# EAGLE schematic SparkFun RTK Express (EAGLE 9.6.2)

## Sheet 1 of 2
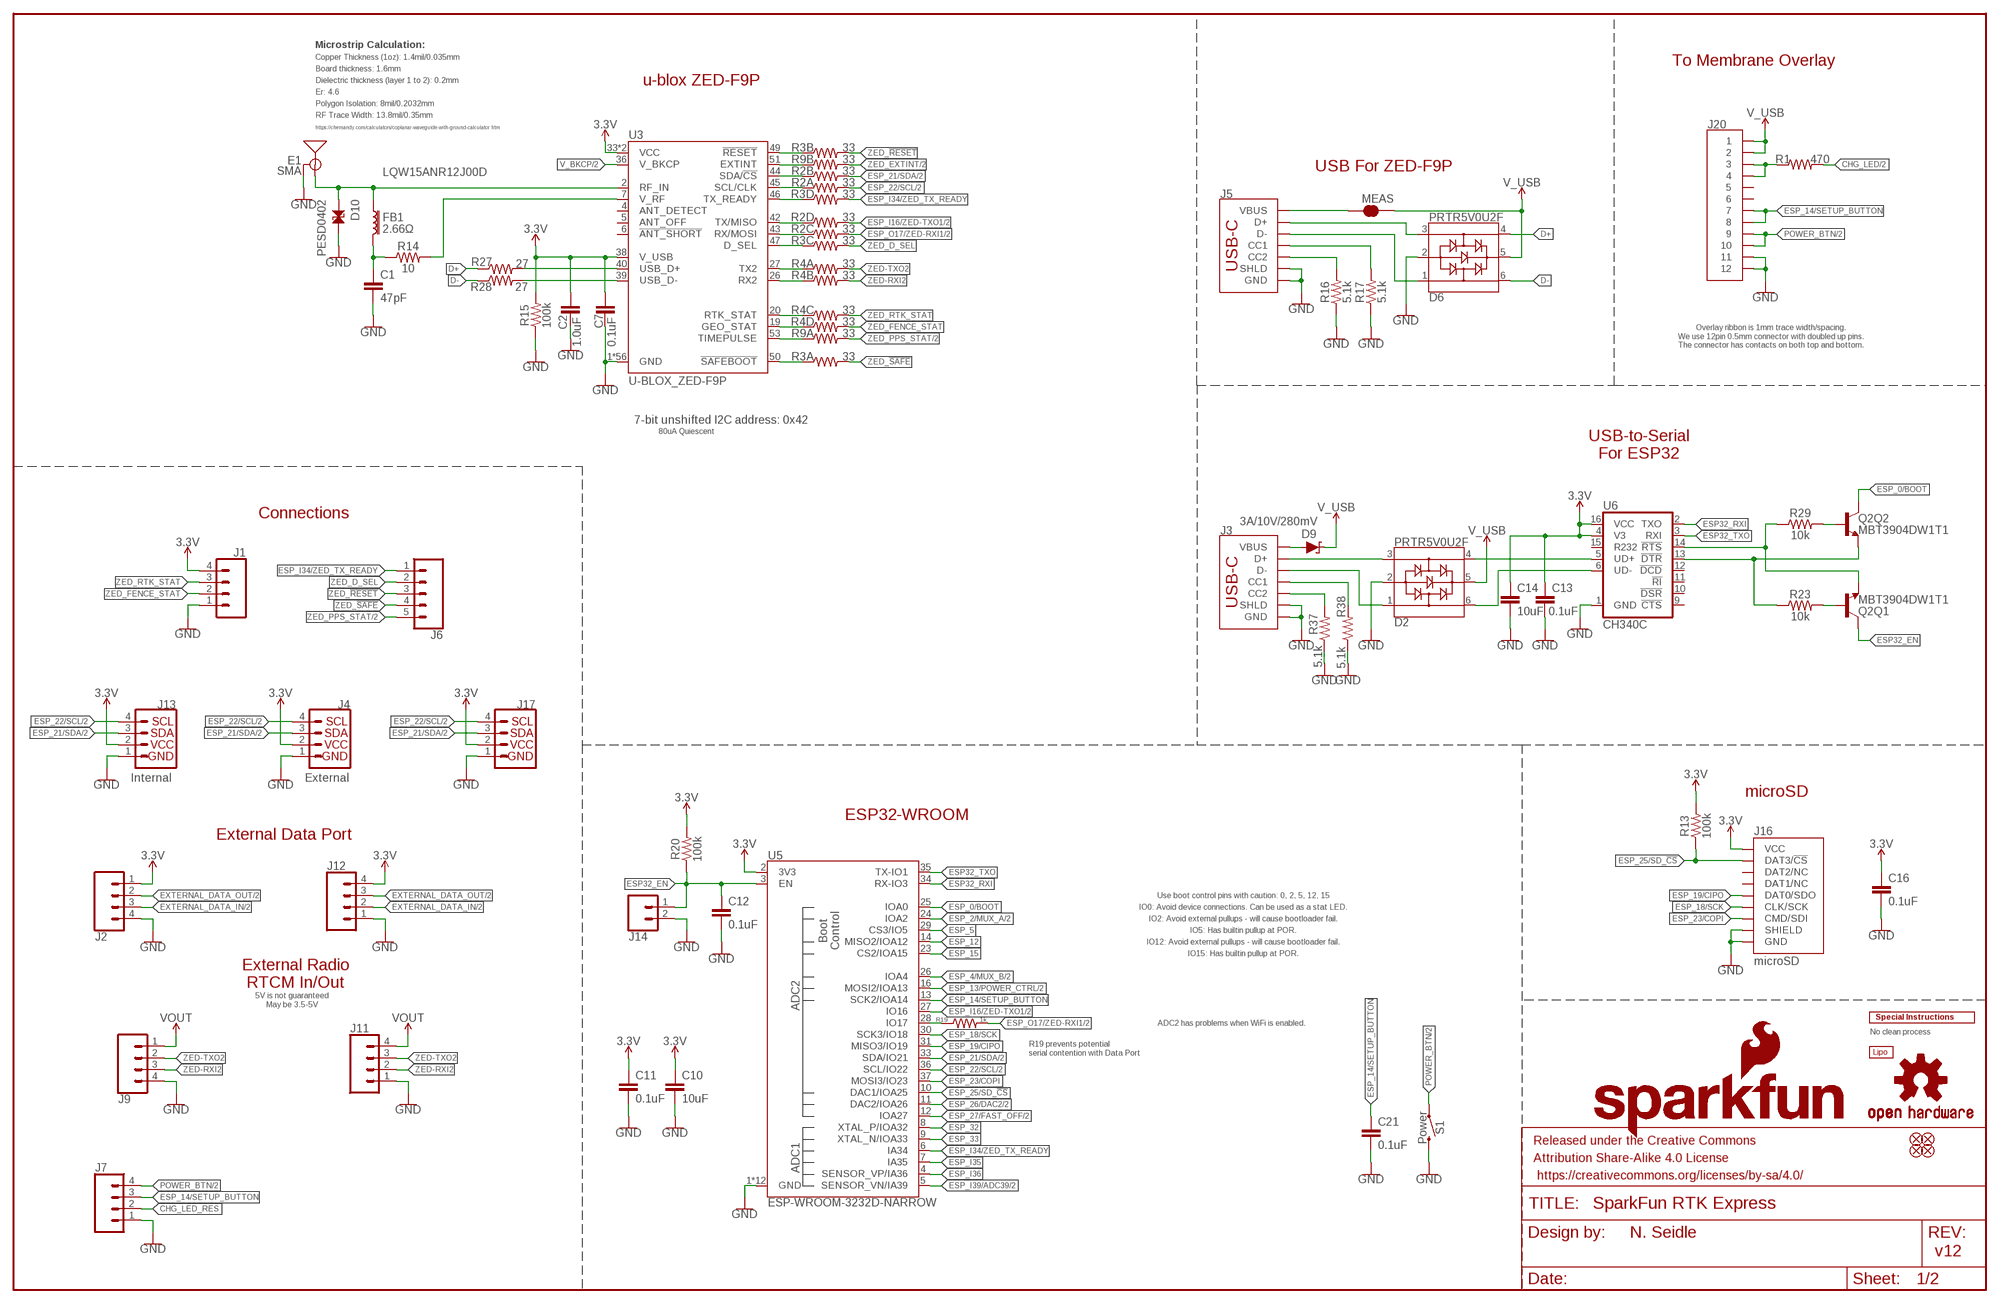
[diagram p0: schematic, sheet 1]

### Parts
BT1  LIPO-OUTLINE1000  [LIPO-1000]
C1  47pF  47PF-0402-25V-5%-X7R  [0402]
C2  1.0uF  1.0UF-0603-16V-10%-X7R  [0603]
C7  0.1uF  0.1UF-0603-25V-5%  [0603]
C10  10uF  10UF-0603-6.3V-20%  [0603]
C11  0.1uF  0.1UF-0603-25V-(+80/-20%)  [0603]
C12  0.1uF  0.1UF-0603-25V-(+80/-20%)  [0603]
C13  0.1uF  0.1UF-0603-25V-(+80/-20%)  [0603]
C14  10uF  10UF-0603-6.3V-20%  [0603]
C16  0.1uF  0.1UF-0603-25V-(+80/-20%)  [0603]
C21  0.1uF  0.1UF-0603-25V-(+80/-20%)  [0603]
D2  PRTR5V0U2F  [SOT886]
D6  PRTR5V0U2F  [SOT886]
D9  3A/10V/280mV  DIODE-SCHOTTKY-BAT60A  [SOD-323]
D10  PESD0402  [0402]
E1  SMA  ANTENNA-SMA-GROUNDEDEDGE_SMA  [SMA-EDGE]
FB1  2.66Ω  FERRITE_BEAD-0402-2.66OHM-1GHZ  [0402-TIGHT]
FRAME2  FRAME-LEDGER  [CREATIVE_COMMONS]
J1  CONN_041X04_NO_SILK_NO_POP  [1X04_NO_SILK]
J2  CONN_04JST-SMD-LOCKING  [JST-4-SMD-1.25MM-LOCKING]
J3  USB Female Type C Connector  USB_C_4-LAYER_PADS  [USB-C-16P_4LAYER-PADS]
J4  External  I2C_STANDARDQWIIC  [JST04_1MM_RA]
J5  USB Female Type C Connector  USB_C_4-LAYER_PADS  [USB-C-16P_4LAYER-PADS]
J6  CONN_05NO_SILK  [1X05_NO_SILK]
J7  CONN_041X04_NO_SILK_NO_POP  [1X04_NO_SILK]
J9  CONN_04JST-SMD-LOCKING  [JST-4-SMD-1.25MM-LOCKING]
J11  CONN_041X04_NO_SILK_NO_POP  [1X04_NO_SILK]
J12  CONN_041X04_NO_SILK_NO_POP  [1X04_NO_SILK]
J13  Internal  I2C_STANDARDQWIIC  [JST04_1MM_RA]
J14  CONN_021X02_NO_SILK  [1X02_NO_SILK]
J16  microSD  MICRO-SD-SDIOPUSH-PUSH  [MICRO-SD-SOCKET]
J17  Qwiic Right Angle  I2C_STANDARD_NO_SILK  [1X04_NO_SILK]
J20  FPC_12_0.5MM_BACKFLIP  [FPC_12_DOUBLESIDED_BACKFLIP]
JP21  FIDUCIALUFIDUCIAL  [FIDUCIAL-MICRO]
JP61  FIDUCIALUFIDUCIAL  [FIDUCIAL-MICRO]
JP71  FIDUCIALUFIDUCIAL  [FIDUCIAL-MICRO]
JP81  FIDUCIALUFIDUCIAL  [FIDUCIAL-MICRO]
LOGO1  OSHW-LOGOMINI  [OSHW-LOGO-MINI]
LOGO2  SFE_LOGO_NAME_FLAME.1_INCH  [SFE_LOGO_NAME_FLAME_.1]
MEAS  JUMPER-COMBO_2_NC_TRACE  [COMBO-JUMPER_2_NC_TRACE]
Q2  MBT3904DW1T1  TRANS_NPN_DUAL-MBT3904DW1T1  [SC70-6]
R1  470  470OHM-0603-1/10W-1%  [0603]
R2  33  33OHM_RA-1206-1/16W-5%  [1206_RA]
R3  33  33OHM_RA-1206-1/16W-5%  [1206_RA]
R4  33  33OHM_RA-1206-1/16W-5%  [1206_RA]
R9  33  33OHM_RA-1206-1/16W-5%  [1206_RA]
R13  100k  100KOHM-0603-1/10W-1%  [0603]
R14  10  10OHM-0603-1/10W-1%  [0603]
R15  100k  100KOHM-0603-1/10W-1%  [0603]
R16  5.1k  5.1KOHM5.1KOHM-0603-1/10W-1%  [0603]
R17  5.1k  5.1KOHM5.1KOHM-0603-1/10W-1%  [0603]
R19  1k  1KOHM-0603-1/10W-1%  [0603]
R20  100k  100KOHM-0603-1/10W-1%  [0603]
R23  10k  10KOHM-0603-1/10W-1%  [0603]
R27  27  27OHM-0603-1/10W-1%  [0603]
R28  27  27OHM-0603-1/10W-1%  [0603]
R29  10k  10KOHM-0603-1/10W-1%  [0603]
R37  5.1k  5.1KOHM5.1KOHM-0603-1/10W-1%  [0603]
R38  5.1k  5.1KOHM5.1KOHM-0603-1/10W-1%  [0603]
S1  Power  MOMENTARY-SWITCH-SPST-SMD-5.2MM-TALL  [TACTILE_SWITCH_SMD_5.2MM]
U3  U-BLOX_ZED-F9P  [ZED-F9P]
U5  ESP-WROOM-3232D-NARROW  [ESP-WROOM-32D-NARROW]
U6  CH340C  [SO016]
U$2  SPECIAL_INSTRUCTIONS-ORDERING  [ORDERING_INSTRUCTIONS]

### Nets
3.3V [power]: C2.1 C7.2 C10.1 C11.1 C13.1 C14.1 C16.1 J1.4 J2.1 J4.2 J12.4 J13.2 J16.VCC J17.2 R13.2 R15.2 R20.2 U3.33(VCC) U3.34(VCC) U3.38(V_USB) U5.2(3V3) U6.4(V3) U6.16(VCC) ; also sheet 2
ANT_VCC: C1.1 FB1.2 R14.1
CC1: J5.A5(CC1) R17.2
CC2: J5.B5(CC2) R16.2
CC3: J3.B5(CC2) R37.2
CC4: J3.A5(CC1) R38.2
CHG_LED: R1.2 ; also sheet 2
CHG_LED_RES: J7.2 J20.3 J20.4 R1.1
D+: D6.4 R27.1
D+1: D2.4 U6.5(UD+)
D-: D6.6 R28.1
D-1: D2.6 U6.6(UD-)
ESP32_!DTR: Q2.1(Q2:E) R23.1 U6.13(!DTR)
ESP32_!RTS: Q2.4(Q1:E) R29.1 U6.14(!RTS)
ESP32_EN: C12.1 J14.1 Q2.3(Q1:C) R20.1 U5.3(EN)
ESP32_RXI: U5.34(RX-IO3) U6.2(TXO)
ESP32_TXO: U5.35(TX-IO1) U6.3(RXI)
ESP_0/BOOT: Q2.6(Q2:C) U5.25(IOA0)
ESP_2/MUX_A: U5.24(IOA2) ; also sheet 2
ESP_4/MUX_B: U5.26(IOA4) ; also sheet 2
ESP_5: U5.29(CS3/IO5)
ESP_12: U5.14(MISO2/IOA12)
ESP_13/POWER_CTRL: U5.16(MOSI2/IOA13) ; also sheet 2
ESP_14/SETUP_BUTTON: C21.1 J7.3 J20.7 J20.8 U5.13(SCK2/IOA14)
ESP_15: U5.23(CS2/IOA15)
ESP_18/SCK: J16.SCLK(CLK/SCK) U5.30(SCK3/IO18)
ESP_19/CIPO: J16.DO/DAT0(DAT0/SDO) U5.31(MISO3/IO19)
ESP_21/SDA: J4.3 J13.3 J17.3 R2.P7 U5.33(SDA/IO21) ; also sheet 2
ESP_22/SCL: J4.4 J13.4 J17.4 R2.P8 U5.36(SCL/IO22) ; also sheet 2
ESP_23/COPI: J16.DI/CMD(CMD/SDI) U5.37(MOSI3/IO23)
ESP_25/SD_!CS!: J16.CS/DAT3(DAT3/!CS!) R13.1 U5.10(DAC1/IOA25)
ESP_26/DAC2: U5.11(DAC2/IOA26) ; also sheet 2
ESP_26/ZED_TX_READY_LV: R3.P4 U3.46(TX_READY)
ESP_27/FAST_OFF: U5.12(IOA27) ; also sheet 2
ESP_32: U5.8(XTAL_P/IOA32)
ESP_33: U5.9(XTAL_N/IOA33)
ESP_D1+: D2.3 J3.A6(D+) J3.B6(D+)
ESP_D1-: D2.1 J3.A7(D-) J3.B7(D-)
ESP_I16/ZED-TXO1: R2.P5 U5.27(IO16) ; also sheet 2
ESP_I34/ZED_TX_READY: J6.1 R3.P5 U5.6(IA34)
ESP_I35: U5.7(IA35)
ESP_I36: U5.4(SENSOR_VP/IA36)
ESP_I39/ADC39: U5.5(SENSOR_VN/IA39) ; also sheet 2
ESP_O17/ZED-RXI1: R2.P6 R19.2 ; also sheet 2
EXTERNAL_DATA_IN: J2.3 J12.2 ; also sheet 2
EXTERNAL_DATA_OUT: J2.2 J12.3 ; also sheet 2
EXTINT_LV: R9.P2 U3.51(EXTINT)
FENCE_LV: R4.P4 U3.19(GEO_STAT)
GND: C1.2 C2.2 C7.1 C10.2 C11.2 C12.2 C13.2 C14.2 C16.2 C21.2 D2.2 D6.2 D10.2 E1.GND@0(GND) E1.GND@1(GND) E1.GND@2(GND) E1.GND@3(GND) J1.1 J2.4 J3.GND J3.GND2(GND) J3.SHLD1(SHLD) J3.SHLD2(SHLD) J3.SHLD3(SHLD) J3.SHLD4(SHLD) J4.1 J5.GND J5.GND2(GND) J5.SHLD1(SHLD) J5.SHLD2(SHLD) J5.SHLD3(SHLD) J5.SHLD4(SHLD) J7.1 J9.4 J11.1 J12.1 J13.1 J14.2 J16.CD1(SHIELD) J16.GND J16.GND1(GND) J16.GND3(GND) J17.1 J20.11 J20.12 R15.1 R16.1 R17.1 R37.1 R38.1 S1.3 U3.1(GND) U3.3(GND) U3.12(GND) U3.14(GND) U3.32(GND) U3.37(GND) U3.41(GND) U3.48(GND) U3.55(GND) U3.56(GND) U3.57(GND) U3.58(GND) U3.59(GND) U3.60(GND) U3.61(GND) U3.62(GND) U3.63(GND) U3.64(GND) U3.65(GND) U3.66(GND) U3.67(GND) U3.68(GND) U3.69(GND) U3.70(GND) U3.71(GND) U3.72(GND) U3.73(GND) U3.74(GND) U3.75(GND) U3.76(GND) U3.77(GND) U3.78(GND) U3.79(GND) U3.80(GND) U3.81(GND) U3.82(GND) U3.83(GND) U3.84(GND) U3.85(GND) U3.86(GND) U3.87(GND) U3.88(GND) U3.89(GND) U3.90(GND) U3.91(GND) U3.92(GND) U3.93(GND) U3.94(GND) U3.95(GND) U3.96(GND) U3.97(GND) U3.98(GND) U3.99(GND) U3.100(GND) U3.101(GND) U3.102(GND) U5.1(GND) U5.15(GND) U5.38(GND) U5.GND1(GND) U5.GNDT1(GND) U5.GNDT2(GND) U5.GNDT3(GND) U5.GNDT4(GND) U5.GNDT5(GND) U5.GNDT6(GND) U5.GNDT7(GND) U5.GNDT8(GND) U6.1(GND) ; also sheet 2
GPS_ANT1 [RF]: D10.1 E1.SIG(SIGNAL) FB1.1 U3.2(RF_IN)
N$4 [power]: J5.VBUS1(VBUS) J5.VBUS2(VBUS) MEAS.1 MEAS.3
N$6: R19.1 U5.28(IO17)
N$11: R27.2 U3.40(USB_D+)
N$12: R28.2 U3.39(USB_D-)
N$13: R14.2 U3.7(V_RF)
N$24: Q2.5(Q1:B) R23.2
N$25: Q2.2(Q2:B) R29.2
N$32 [power]: D9.A J3.VBUS1(VBUS) J3.VBUS2(VBUS)
POWER_BTN: J7.4 J20.9 J20.10 S1.1 ; also sheet 2
PPS: R9.P1 U3.53(TIMEPULSE)
RTK_LV: R4.P3 U3.20(RTK_STAT)
RX2_LV: R4.P2 U3.26(RX2)
RXLV: R2.P3 U3.43(RX/MOSI)
SCL_LV: R2.P1 U3.45(SCL/CLK)
SDA_LV: R2.P2 U3.44(SDA/!CS!)
TX2_LV: R4.P1 U3.27(TX2)
TXLV: R2.P4 U3.42(TX/MISO)
UNP_D+: D6.3 J5.A6(D+) J5.B6(D+)
UNP_D-: D6.1 J5.A7(D-) J5.B7(D-)
V_BKCP [power]: U3.36(V_BKCP) ; also sheet 2
V_USB [power]: D2.5 D6.5 D9.C J20.1 J20.2 MEAS.2 MEAS.4 ; also sheet 2
VOUT: J9.1 J11.4 ; also sheet 2
ZED-RXI2: J9.3 J11.2 R4.P7
ZED-TXO2: J9.2 J11.3 R4.P8
ZED_!RESET!: J6.3 R3.P7
ZED_!RESET!_LV: R3.P2 U3.49(!RESET!)
ZED_!SAFE!: J6.4 R3.P8
ZED_!SAFE!_LV: R3.P1 U3.50(!SAFEBOOT!)
ZED_D_SEL: J6.2 R3.P6
ZED_D_SEL_LV: R3.P3 U3.47(D_SEL)
ZED_EXTINT: R9.P7 ; also sheet 2
ZED_FENCE_STAT: J1.2 R4.P5
ZED_PPS_STAT: J6.5 R9.P8 ; also sheet 2
ZED_RTK_STAT: J1.3 R4.P6
Unconnected: J16.DAT1(DAT1/NC) J16.DAT2(DAT2/NC) J20.5 J20.6 R9.P3 R9.P4 R9.P5 R9.P6 U3.4(ANT_DETECT) U3.5(ANT_OFF) U3.6(!ANT_SHORT!) U6.9(!CTS) U6.10(!DSR) U6.11(!RI) U6.12(!DCD) U6.15(R232)

### Notes on the sheet
- Microstrip Calculation:
- Copper Thickness (1oz): 1.4mil/0.035mm | To Membrane Overlay
- Board thickness: 1.6mm
- u-blox ZED-F9P
- Dielectric thickness (layer 1 to 2): 0.2mm
- Er: 4.6
- Polygon Isolation: 8mil/0.2032mm
- RF Trace Width: 13.8mil/0.35mm
- https://chemandy.com/calculators/coplanar-waveguide-with-ground-calculator.htm
- USB For ZED-F9P
- LQW15ANR12J00D
- Overlay ribbon is 1mm trace width/spacing.
  We use 12pin 0.5mm connector with doubled up pins.
  The connector has contacts on both top and bottom.
- 7-bit unshifted I2C address: 0x42
- 80uA Quiescent
- USB-to-Serial
  For ESP32
- Connections
- microSD
- ESP32-WROOM
- External Data Port
- Use boot control pins with caution: 0, 2, 5, 12, 15
- IO0: Avoid device connections. Can be used as a stat LED.
- IO2: Avoid external pullups - will cause bootloader fail.
- IO5: Has builtin pullup at POR.
- IO12: Avoid external pullups - will cause bootloader fail.
- IO15: Has builtin pullup at POR.
- External Radio
  RTCM In/Out
- 5V is not guaranteed
  May be 3.5-5V
- ADC2 has problems when WiFi is enabled.
- No clean process
- R19 prevents potential
  serial contention with Data Port
- N. Seidle
- v12

## Sheet 2 of 2
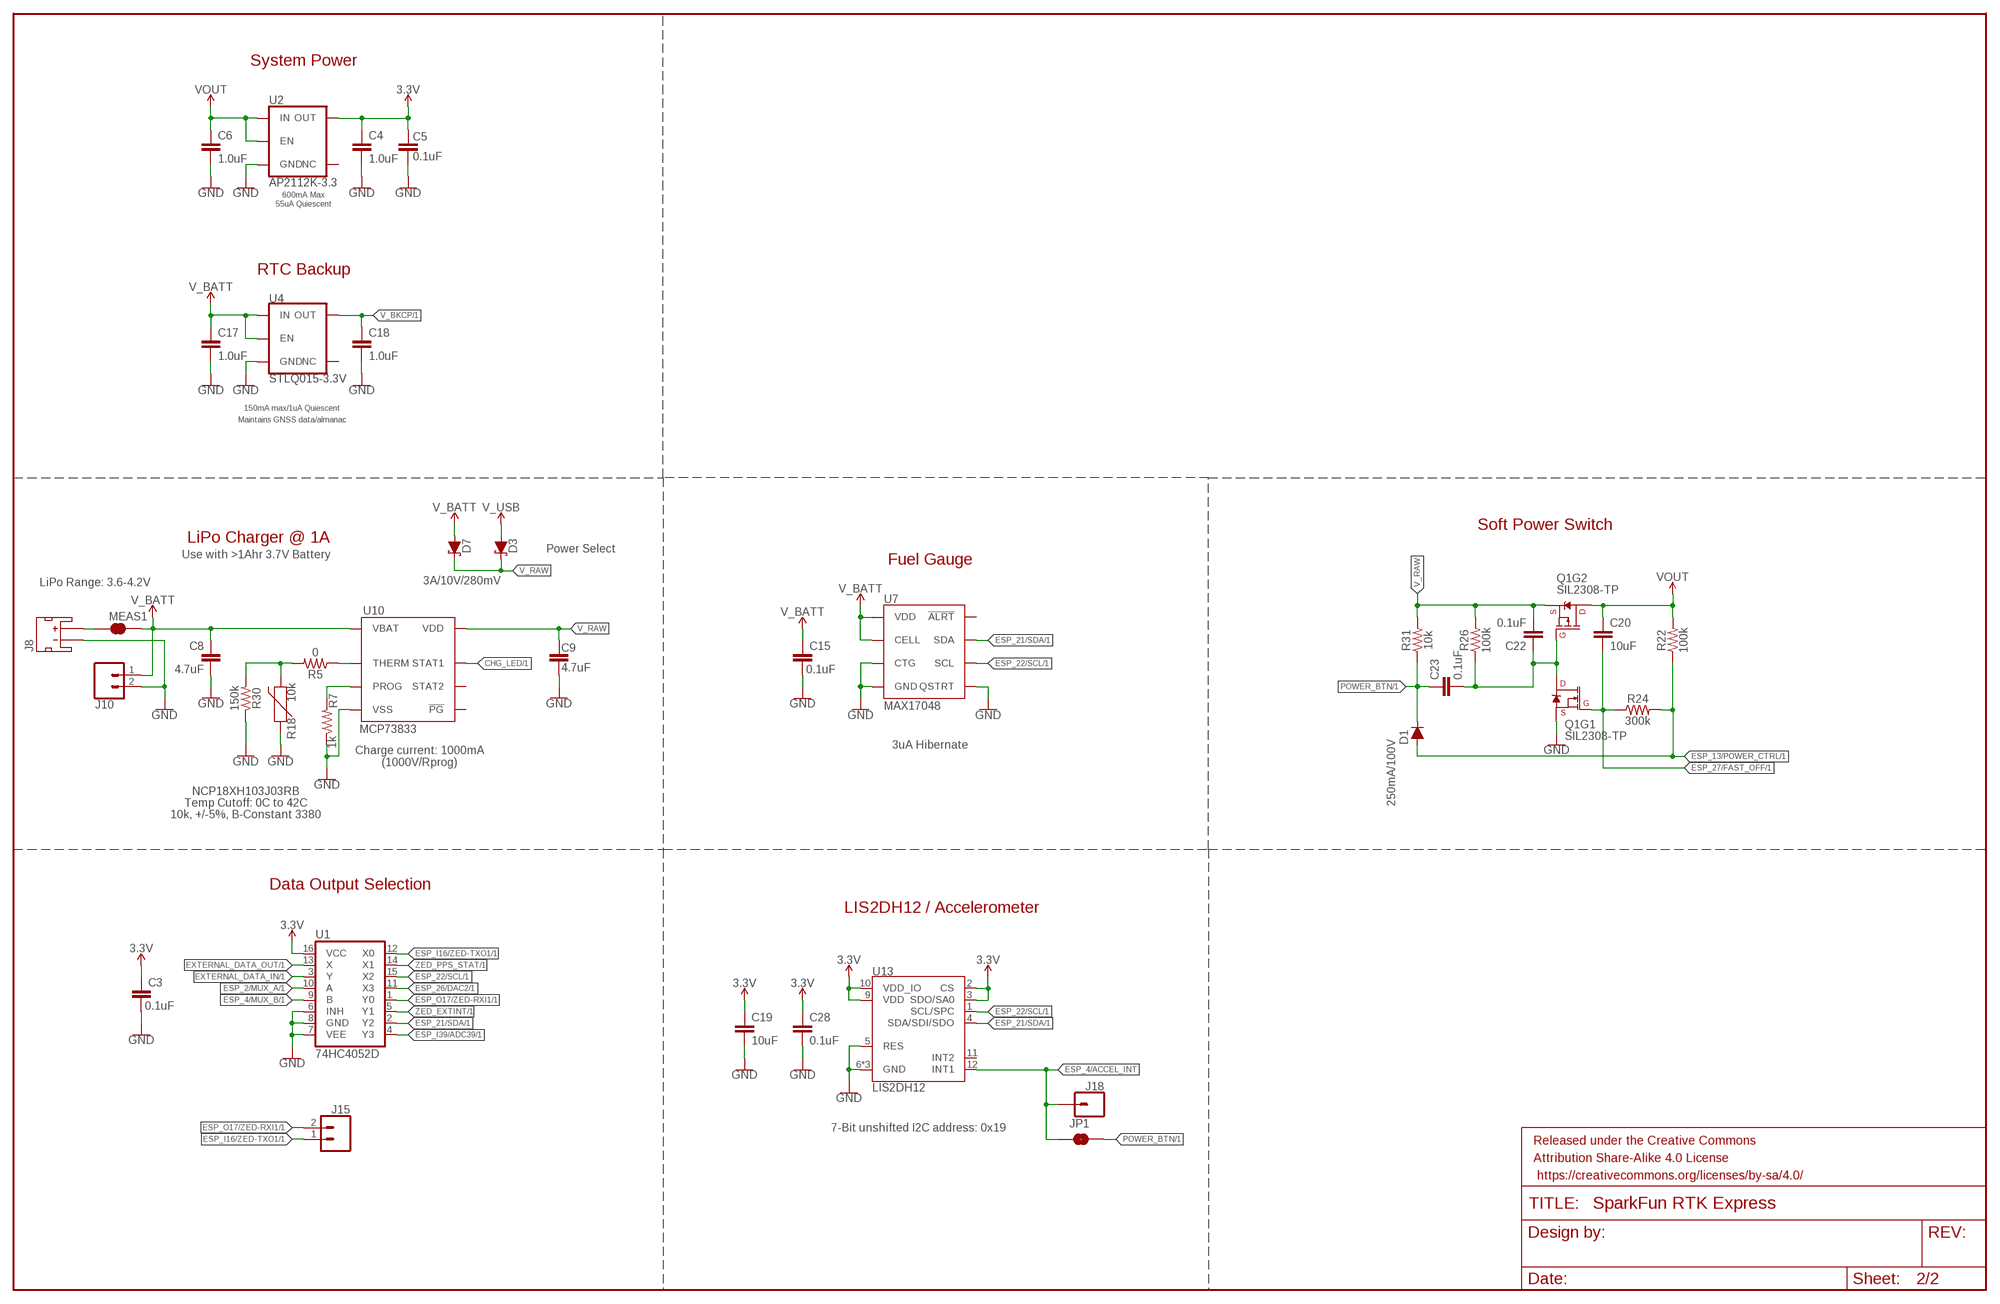
[diagram p1: schematic, sheet 2]

### Parts
C3  0.1uF  0.1UF-0603-25V-(+80/-20%)  [0603]
C4  1.0uF  1.0UF-0603-16V-10%-X7R  [0603]
C5  0.1uF  0.1UF-0603-25V-5%  [0603]
C6  1.0uF  1.0UF-0603-16V-10%-X7R  [0603]
C8  4.7uF  4.7UF-0603-35V-(20%)  [0603]
C9  4.7uF  4.7UF-0603-35V-(20%)  [0603]
C15  0.1uF  0.1UF-0603-25V-(+80/-20%)  [0603]
C17  1.0uF  1.0UF-0603-16V-10%-X7R  [0603]
C18  1.0uF  1.0UF-0603-16V-10%-X7R  [0603]
C19  10uF  10UF-0603-6.3V-20%  [0603]
C20  10uF  10UF-0603-6.3V-20%  [0603]
C22  0.1uF  0.1UF-0603-25V-5%  [0603]
C23  0.1uF  0.1UF-0603-25V-5%  [0603]
C28  0.1uF  0.1UF-0603-25V-(+80/-20%)  [0603]
D1  250mA/100V  DIODE-BAS16J  [SOD-323]
D3  3A/10V/280mV  DIODE-SCHOTTKY-BAT60A  [SOD-323]
D7  3A/10V/280mV  DIODE-SCHOTTKY-BAT60A  [SOD-323]
FRAME3  FRAME-LEDGERNO_FOOTPRINT  [DUMMY]
J8  JST_2MM_MALE  [JST-2-SMD]
J10  CONN_021X02_NO_SILK  [1X02_NO_SILK]
J15  CONN_021X02_NO_SILK  [1X02_NO_SILK]
J18  CONN_01PTH_NO_SILK_YES_STOP  [1X01_NO_SILK]
JP1  JUMPER-SMT_2_NO_SILK  [SMT-JUMPER_2_NO_SILK]
MEAS1  JUMPER-COMBO_2_NC_TRACE  [COMBO-JUMPER_2_NC_TRACE]
Q1  SIL2308-TP  MOSFET_COMPLIMENTARY_PAIR-SIL2308  [SOT26]
R5  0  0OHM-0603-1/10W  [0603]
R7  1k  1KOHM-0603-1/10W-1%  [0603]
R18  10k  NTC-THERMISTOR-0603  [0603]
R22  100k  100KOHM-0603-1/10W-1%  [0603]
R24  300k  300KOHM-0603-1/10W-1%  [0603]
R26  100k  100KOHM-0603-1/10W-1%  [0603]
R30  150k  150KOHM-0603-1/10W-1%  [0603]
R31  10k  10KOHM-0603-1/10W-1%  [0603]
U1  74HC4052D  [SO16]
U2  AP2112K-3.3  V_REG_AP2112K-3.3V  [SOT23-5]
U4  STLQ015-3.3V  [SOT23-5]
U7  MAX17048  MAX17048DFN8  [DFN-8]
U10  MCP73833  [DFN-10]
U13  LIS2DH12  [LGA-12-LISDH12]

### Nets
3.3V [power]: C3.1 C4.1 C5.2 C19.1 C28.1 U1.16(VCC) U2.5(OUT) U13.2(CS) U13.3(SDO/SA0) U13.9(VDD) U13.10(VDD_IO) ; also sheet 1
CHG_LED: U10.3(STAT1) ; also sheet 1
CHG_THERM1: R5.2 R18.2 R30.2
ESP_2/MUX_A: U1.10(A) ; also sheet 1
ESP_4/ACCEL_INT: J18.1 JP1.1 U13.12(INT1)
ESP_4/MUX_B: U1.9(B) ; also sheet 1
ESP_13/POWER_CTRL: D1.A R22.1 R24.2 ; also sheet 1
ESP_21/SDA: U1.2(Y2) U7.8(SDA) U13.4(SDA/SDI/SDO) ; also sheet 1
ESP_22/SCL: U1.15(X2) U7.7(SCL) U13.1(SCL/SPC) ; also sheet 1
ESP_26/DAC2: U1.11(X3) ; also sheet 1
ESP_27/FAST_OFF: C20.2 Q1.G1(G) R24.1 ; also sheet 1
ESP_I16/ZED-TXO1: J15.1 U1.12(X0) ; also sheet 1
ESP_I39/ADC39: U1.4(Y3) ; also sheet 1
ESP_O17/ZED-RXI1: J15.2 U1.1(Y0) ; also sheet 1
EXTERNAL_DATA_IN: U1.3(Y) ; also sheet 1
EXTERNAL_DATA_OUT: U1.13(X) ; also sheet 1
GND: C3.2 C4.2 C5.1 C6.2 C8.2 C9.2 C15.2 C17.2 C18.2 C19.2 C28.2 J8.1(-) J10.2 Q1.S1(S) R7.1 R18.1 R30.1 U1.6(INH) U1.7(VEE) U1.8(GND) U2.2(GND) U4.2(GND) U7.1(CTG) U7.4(GND) U7.6(QSTRT) U7.9(GND) U10.5(VSS) U10.11(VSS) U13.5(RES) U13.6(GND) U13.7(GND) U13.8(GND) ; also sheet 1
LIPO_RAW: J8.2(+) MEAS1.1 MEAS1.3
N$5: R5.1 U10.8(THERM)
N$15: C22.1 C23.2 Q1.D1(D) Q1.G2(G) R26.1
POWER_BTN: C23.1 D1.C JP1.2 R31.1 ; also sheet 1
PROG1: R7.2 U10.6(PROG)
V_BATT [power]: C8.1 C15.1 C17.1 D7.A J10.1 MEAS1.2 MEAS1.4 U4.1(IN) U4.3(EN) U7.2(CELL) U7.3(VDD) U10.9(VBAT) U10.10(VBAT)
V_BKCP [power]: C18.1 U4.5(OUT) ; also sheet 1
V_RAW [power]: C9.1 C22.2 D3.C D7.C Q1.S2(S) R26.2 R31.2 U10.1(VDD) U10.2(VDD)
V_USB [power]: D3.A ; also sheet 1
VOUT: C6.1 C20.1 Q1.D2(D) R22.2 U2.1(IN) U2.3(EN) ; also sheet 1
ZED_EXTINT: U1.5(Y1) ; also sheet 1
ZED_PPS_STAT: U1.14(X1) ; also sheet 1
Unconnected: J8.NC1(PAD1) J8.NC2(PAD2) U2.4(NC) U4.4(NC) U7.5(!ALRT) U10.4(STAT2) U10.7(!PG) U13.11(INT2)

### Notes on the sheet
- System Power
- 600mA Max
  55uA Quiescent
- RTC Backup
- 150mA max/1uA Quiescent
- Maintains GNSS data/almanac
- Soft Power Switch
- LiPo Charger @ 1A
- Power Select
- Use with >1Ahr 3.7V Battery
- Fuel Gauge
- LiPo Range: 3.6-4.2V
- 3uA Hibernate
- Charge current: 1000mA
  (1000V/Rprog)
- NCP18XH103J03RB
- Temp Cutoff: 0C to 42C
- 10k, +/-5%, B-Constant 3380
- Data Output Selection
- LIS2DH12 / Accelerometer
- 7-Bit unshifted I2C address: 0x19

## Library data of the parts
BT1 = SparkFun-Batteries:LIPO-OUTLINE: LiPo Battery Outlines Outlines for common LiPo batteries sold by SparkFun. (Note: no terminals or connection points, just the dimensions.) SparkFun Products Polymer Lithium Ion Battery - 110mAh <https://www.sparkfun.com/products/13853> (PRT-13853) Polymer Lithium Ion Battery - 1000mAh <https://www.sparkfun.com/products/13813> (PRT-13813) Polymer Lithium Ion Battery - 2000mAh <https://www.sparkfun.com/products/8483> (PRT-08483); PROD_ID: BATT-13243; SF_SKU: PRT-13813
C1 = SparkFun-Capacitors:47PF: 47pF ceramic capacitors A capacitor is a passive two-terminal electrical component used to store electrical energy temporarily in an electric field.; PROD_ID: CAP-15063
C2 C4 C6 C17 C18 = SparkFun-Capacitors:1.0UF: 1µF ceramic capacitors A capacitor is a passive two-terminal electrical component used to store electrical energy temporarily in an electric field.; PROD_ID: CAP-13930
C3 C11-C13 C15 C16 C21 C28 = SparkFun-Capacitors:0.1UF: 0.1µF ceramic capacitors A capacitor is a passive two-terminal electrical component used to store electrical energy temporarily in an electric field.; PROD_ID: CAP-00810
C5 C7 C22 C23 = SparkFun-Capacitors:0.1UF: 0.1µF ceramic capacitors A capacitor is a passive two-terminal electrical component used to store electrical energy temporarily in an electric field.; PROD_ID: CAP-08604
C8 C9 = SparkFun-Capacitors:4.7UF: 4.7µF ceramic capacitors A capacitor is a passive two-terminal electrical component used to store electrical energy temporarily in an electric field.; PROD_ID: CAP-14106
C10 C14 C19 C20 = SparkFun-Capacitors:10UF: 10.0µF ceramic capacitors A capacitor is a passive two-terminal electrical component used to store electrical energy temporarily in an electric field.; PROD_ID: CAP-11015
D1 = SparkFun-DiscreteSemi:DIODE: Diode These are standard reverse protection diodes and small signal diodes. SparkFun Products: SparkFun SparkPunk Sound Kit <https://www.sparkfun.com/products/11177> SparkFun ESP8266 Thing <https://www.sparkfun.com/products/13231>; PROD_ID: DIO-09646
D2 D6 = SparkFun-IC-Power:PRTR5V0U2: A small ESD protection device. Most commonly used on USB D+/D- signals to protect large, expensive, or especially sensitive USB enabled devices.; PROD_ID: DIO-14084
D3 D7 D9 = SparkFun-DiscreteSemi:DIODE-SCHOTTKY: Schottky diode A Schottky diode is a semiconductor diode which has a low forward voltage drop and a very fast switching action.; PROD_ID: DIO-14072
D10 = SparkFun-DiscreteSemi:PESD0402: ESD protection diode PESD is used to protect a signal line from ESD.; DIGIKEY_PART: PESD0402-140CT-ND; MOUSE_PART: 650-PESD0402-140; PROD_ID: DIO-15359
E1 = SparkFun-RF:ANTENNA-SMA-GROUNDED: SMA Antenna Connector w/ Ground Edge-mount and SMD SMA connectors for RF Antennas. **4-LAYER BOARD WARNING!!** When designing a 4-layer board using any of the SMD variants, you will need to manually add a cutout polygon on any internal power layers to make sure that you don't end up with exposed copper around the edge of the routed hole for these connectors. Exposed power copper could then short to the connector body - and that would be bad. Why hasn't anyone added the cutout polygons directly to the connector footprint? Well, your internal layers (usually 2 and 15) may be covered with GND polygons and you might well want the copper to go all the way to the edge, especially under the connector SIGNAL pin. So adding cutouts to the footprint might make matters worse, not better...; PROD_ID: CONN-08289
FB1 = SparkFun-Coils:FERRITE_BEAD: Ferrite Bead (blocks, cores, rings, chokes, etc.) Inductor with layers of ferrite used to suppress high frequencies. Often used to isolate high frequency noise. SparkFun Products: IOIO-OTG - V2.2 <https://www.sparkfun.com/products/13613> SparkFun SAMD21 Mini Breakout <https://www.sparkfun.com/products/13664> SparkFun 6 Degrees of Freedom Breakout - LSM6DS3 <https://www.sparkfun.com/products/13339> SparkFun SAMD21 Dev Breakout <https://www.sparkfun.com/products/13672>; PROD_ID: NDUC-15072
FRAME2 FRAME3 = SparkFun-Aesthetics:FRAME-LEDGER: Schematic Frame - Ledger Standard 11x14 US Ledger frame
J1 J7 J11 J12 = SparkFun-Connectors:CONN_04: Multi connection point. Often used as Generic Header-pin footprint for 0.1 inch spaced/style header connections On any of the 0.1 inch spaced packages, you can populate with these: Break Away Headers - Straight <https://www.sparkfun.com/products/116> (PRT-00116) Break Away Male Headers - Right Angle <https://www.sparkfun.com/products/553> (PRT-00553) Female Headers <https://www.sparkfun.com/products/115> (PRT-00115) Break Away Headers - Machine Pin <https://www.sparkfun.com/products/117> (PRT-00117) Break Away Female Headers - Swiss Machine Pin <https://www.sparkfun.com/products/743> (PRT-00743) For SCREWTERMINALS and SPRING TERMINALS visit here: Screw Terimnals on SparkFun.com <https://www.sparkfun.com/search/results?term=Screw+Terminals> (5mm/3.5mm/2.54mm spacing) This device is also useful as a general connection point to wire up your design to another part of your project. Our various solder wires solder well into these plated through hole pads. Hook-Up Wire - Assortment (Stranded, 22 AWG) <https://www.sparkfun.com/products/11375> (PRT-11375) Hook-Up Wire - Assortment (Solid Core, 22 AWG) <https://www.sparkfun.com/products/11367> (PRT-11367) View the entire wire category on our website here <https://www.sparkfun.com/categories/141> Special notes: Molex polarized connector foot print use with SKU : PRT-08231 with associated crimp pins and housings. 1MM SMD Version SKU: PRT-10208
J2 J9 = SparkFun-Connectors:CONN_04: Multi connection point. Often used as Generic Header-pin footprint for 0.1 inch spaced/style header connections On any of the 0.1 inch spaced packages, you can populate with these: Break Away Headers - Straight <https://www.sparkfun.com/products/116> (PRT-00116) Break Away Male Headers - Right Angle <https://www.sparkfun.com/products/553> (PRT-00553) Female Headers <https://www.sparkfun.com/products/115> (PRT-00115) Break Away Headers - Machine Pin <https://www.sparkfun.com/products/117> (PRT-00117) Break Away Female Headers - Swiss Machine Pin <https://www.sparkfun.com/products/743> (PRT-00743) For SCREWTERMINALS and SPRING TERMINALS visit here: Screw Terimnals on SparkFun.com <https://www.sparkfun.com/search/results?term=Screw+Terminals> (5mm/3.5mm/2.54mm spacing) This device is also useful as a general connection point to wire up your design to another part of your project. Our various solder wires solder well into these plated through hole pads. Hook-Up Wire - Assortment (Stranded, 22 AWG) <https://www.sparkfun.com/products/11375> (PRT-11375) Hook-Up Wire - Assortment (Solid Core, 22 AWG) <https://www.sparkfun.com/products/11367> (PRT-11367) View the entire wire category on our website here <https://www.sparkfun.com/categories/141> Special notes: Molex polarized connector foot print use with SKU : PRT-08231 with associated crimp pins and housings. 1MM SMD Version SKU: PRT-10208; PROD_ID: CONN-15303
J3 J5 = SparkFun-Connectors:USB_C: USB Type C 16Pin Connector Super Speed pins not available on the 16-pin purely SMD connector so this part is best for USB 2.0 implementations. D1 and D2 are tied together enabling D+/- no matter which way the cable is plugged into the connector. The two channel configuration pins (CC1/2) are exposed. These are normally connected to ground via 5.1k resistors but can be reconfigured for high current/high power applications. **4-LAYER BOARD WARNING!!** If designing 4-layer board, make sure to select the variant _4-LAYER-ISOLATED. The linked footprint (USB-C-16-4LAYER-ISOLATED) includes some very necessary cutout polygons in the inner layers (2 and 15). This prevents the PTH mounting shield legs on the USB connector from electrically connecting any other polygons on the inner layers (usually VCC and GND).; PROD_ID: CONN-14122
J4 J13 = SparkFun-Connectors:I2C_STANDARD: SparkFun I2C Standard Pinout Header SparkFun has standardized on a pinout for all I2C based sensor breakouts. This pinout allows I2C boards to be plugged directly into the headers on Arduino Uno compatible boards, and to be daisy chained easily. Example SparkFun Products: SparkFun Atmospheric Sensor Breakout - BME280 <https://www.sparkfun.com/products/13676> SparkFun Altitude/Pressure Sensor Breakout - MPL3115A2 <https://www.sparkfun.com/products/11084> SparkFun TOF Range Finder Sensor - VL6180 <https://www.sparkfun.com/products/12785>; PROD_ID: CONN-13694; VALUE: Qwiic Right Angle
J6 = SparkFun-Connectors:CONN_05: Multi connection point. Often used as Generic Header-pin footprint for 0.1 inch spaced/style header connections On any of the 0.1 inch spaced packages, you can populate with these: Break Away Headers - Straight <https://www.sparkfun.com/products/116> (PRT-00116) Break Away Male Headers - Right Angle <https://www.sparkfun.com/products/553> (PRT-00553) Female Headers <https://www.sparkfun.com/products/115> (PRT-00115) Break Away Headers - Machine Pin <https://www.sparkfun.com/products/117> (PRT-00117) Break Away Female Headers - Swiss Machine Pin <https://www.sparkfun.com/products/743> (PRT-00743) For SCREWTERMINALS and SPRING TERMINALS visit here: Screw Terimnals on SparkFun.com <https://www.sparkfun.com/search/results?term=Screw+Terminals> (5mm/3.5mm/2.54mm spacing) This device is also useful as a general connection point to wire up your design to another part of your project. Our various solder wires solder well into these plated through hole pads. Hook-Up Wire - Assortment (Stranded, 22 AWG) <https://www.sparkfun.com/products/11375> (PRT-11375) Hook-Up Wire - Assortment (Solid Core, 22 AWG) <https://www.sparkfun.com/products/11367> (PRT-11367) View the entire wire category on our website here <https://www.sparkfun.com/categories/141> Special notes: Molex polarized connector foot print use with SKU : PRT-08231 with associated crimp pins and housings. 1MM SMD Version SKU: PRT-10208
J8 = SparkFun-Connectors:JST_2MM_MALE: JST 2MM MALE RA CONNECTOR Two pin, compact surface mount connector. Commonly used as a battery input connection point. We really like the solid locking feeling and high current rating on these small connectors. We use these all the time as battery connectors. Mates to single-cell LiPo batteries. Here is the connector we sell at SparkFun: JST Right Angle Connector - White <https://www.sparkfun.com/products/8612> (PRT-08612) Datasheet <http://www.sparkfun.com/datasheets/Prototyping/Connectors/JST-Horizontal.pdf> It was used on these SparkFun products: SparkFun MOSFET Power Controller <https://www.sparkfun.com/products/11214> (PRT-11214) SparkFun Battery Babysitter - LiPo Battery Manager <https://www.sparkfun.com/products/13777> (PRT-13777) And many, many others that required a lipo battery connection.; PROD_ID: CONN-11443; SF_ID: PRT-08612
J10 J14 J15 = SparkFun-Connectors:CONN_02: Multi connection point. Often used as Generic Header-pin footprint for 0.1 inch spaced/style header connections On any of the 0.1 inch spaced packages, you can populate with these: Break Away Headers - Straight <https://www.sparkfun.com/products/116> (PRT-00116) Break Away Male Headers - Right Angle <https://www.sparkfun.com/products/553> (PRT-00553) Female Headers <https://www.sparkfun.com/products/115> (PRT-00115) Break Away Headers - Machine Pin <https://www.sparkfun.com/products/117> (PRT-00117) Break Away Female Headers - Swiss Machine Pin <https://www.sparkfun.com/products/743> (PRT-00743) For SCREWTERMINALS and SPRING TERMINALS visit here: Screw Terimnals on SparkFun.com <https://www.sparkfun.com/search/results?term=Screw+Terminals> (5mm/3.5mm/2.54mm spacing) This device is also useful as a general connection point to wire up your design to another part of your project. Our various solder wires solder well into these plated through hole pads. Hook-Up Wire - Assortment (Stranded, 22 AWG) <https://www.sparkfun.com/products/11375> (PRT-11375) Hook-Up Wire - Assortment (Solid Core, 22 AWG) <https://www.sparkfun.com/products/11367> (PRT-11367) View the entire wire category on our website here <https://www.sparkfun.com/categories/141> Special notes: Molex polarized connector foot print use with: PRT-08233 with associated crimp pins and housings. 2.54_SCREWTERM for use with PRT-10571. 3.5mm Screw Terminal footprints for PRT-08084 5mm Screw Terminal footprints for use with PRT-08432
J16 = SparkFun-Connectors:MICRO-SD-SDIO: microSD Socket for Transflash Push-push type µSD socket. tDoc lines correctly indicate media card edge positions when inserting (unlocked, locked, depressed). NOTE: CD1 and CD2 are connected internally, and the default detect state of the socket is detect pin to ground. SparkFun Products: WAV Trigger <https://www.sparkfun.com/products/13660> CAN-Bus Shield <https://www.sparkfun.com/products/13262> SparkFun Level Shifing microSD Breakout <https://www.sparkfun.com/products/13743>; PROD_ID: CONN-07820
J17 = SparkFun-Connectors:I2C_STANDARD: SparkFun I2C Standard Pinout Header SparkFun has standardized on a pinout for all I2C based sensor breakouts. This pinout allows I2C boards to be plugged directly into the headers on Arduino Uno compatible boards, and to be daisy chained easily. Example SparkFun Products: SparkFun Atmospheric Sensor Breakout - BME280 <https://www.sparkfun.com/products/13676> SparkFun Altitude/Pressure Sensor Breakout - MPL3115A2 <https://www.sparkfun.com/products/11084> SparkFun TOF Range Finder Sensor - VL6180 <https://www.sparkfun.com/products/12785>
J18 = SparkFun-Connectors:CONN_01: Single connection point. Often used as Generic Header-pin footprint for 0.1 inch spaced/style header connections On any of the 0.1 inch spaced packages, you can populate with these: Break Away Headers - Straight <https://www.sparkfun.com/products/116> (PRT-00116) Break Away Male Headers - Right Angle <https://www.sparkfun.com/products/553> (PRT-00553) Female Headers <https://www.sparkfun.com/products/115> (PRT-00115) Break Away Headers - Machine Pin <https://www.sparkfun.com/products/117> (PRT-00117) Break Away Female Headers - Swiss Machine Pin <https://www.sparkfun.com/products/743> (PRT-00743) This device is also useful as a general connection point to wire up your design to another part of your project. Our various solder wires solder well into these plated through hole pads. Hook-Up Wire - Assortment (Stranded, 22 AWG) <https://www.sparkfun.com/products/11375> (PRT-11375) Hook-Up Wire - Assortment (Solid Core, 22 AWG) <https://www.sparkfun.com/products/11367> (PRT-11367) View the entire wire category on our website here <https://www.sparkfun.com/categories/141> Special notes: SMTSO-256-ET is a "flush mount" nut for a 4-40 screw. We mostly use this on specialty testbeds; it is a nice way to connect hardware to your PCB at an adjustable hieght. Also note, the SNAP packages are for using a snappable style connector. We sell a baggie of snaps and they are also used on two LilyPad designs: Snap Assortment - 30 pack (male and female) <https://www.sparkfun.com/products/11347> (DEV-11347) LilyPad Arduino SimpleSnap <https://www.sparkfun.com/products/10941> (DEV-10941) LilyPad SimpleSnap Protoboard <https://www.sparkfun.com/products/10940> (DEV-10940)
J20 = RTK Facet:FPC_12_0.5MM; PROD_ID: CONN-15766
JP1 = SparkFun-Jumpers:JUMPER-SMT_2_NO: Normally open jumper This jumper has two pads in close proximity to each other. Apply solder to close the connection. Round pads are easier to solder for beginners, but are a lot larger. SparkFun Product that uses the round pads: SparkFun EL Sequencer <https://www.sparkfun.com/products/12781>
JP21 JP61 JP71 JP81 = SparkFun-Aesthetics:FIDUCIAL: Fiducial Alignment Points Point-of-reference for pick-and-place machines and other optical instruments.
LOGO1 = SparkFun-Aesthetics:OSHW-LOGO: Open-Source Hardware (OSHW) Logo This logo indicates the piece of hardware it is found on incorporates a OSHW license and/or adheres to the definition of open source hardware found here: http://freedomdefined.org/OSHW
LOGO2 = SparkFun-Aesthetics:SFE_LOGO_NAME_FLAME: SparkFun Font Logo w/ Flame This is the SparkFun full logo. The logo on the schematic will always be the same size; the package variant is the height of the flame part of the logo. Default layer for the logo on the board is tSilk.
MEAS MEAS1 = SparkFun-Jumpers:JUMPER-COMBO_2_NC_TRACE
Q1 = SparkFun-DiscreteSemi:MOSFET_COMPLIMENTARY_PAIR: Complementary pair enhancement mode MOSFET 1A and 4A A P and N channel MOSFET in a single package. Rated to breakdown at 20V. DMC2700 is 1A. SIL2308 is 4A. Link to datasheet <http://www.diodes.com/_files/datasheets/DMC2700UDM.pdf> SparkFun Products: ZX Distance and Gesture Sensor <https://www.sparkfun.com/products/12780>; PROD_ID: TRANS-15717
Q2 = SparkFun-DiscreteSemi:TRANS_NPN_DUAL: Dual NPN Transistors in Single Package The MBT3904W1 puts two general purpose 3904 NPN transistors in a single package. Datasheet <http://www.onsemi.com/pub_link/Collateral/MBT3904DW1T1-D.PDF> SparkFun Products: SparkFun ESP32 Thing <https://www.sparkfun.com/products/13907>; PROD_ID: TRANS-13337
R1 = SparkFun-Resistors:470OHM: 470Ω resistor A resistor is a passive two-terminal electrical component that implements electrical resistance as a circuit element. Resistors act to reduce current flow, and, at the same time, act to lower voltage levels within circuits. - Wikipedia; PROD_ID: RES-07869
R2-R4 R9 = SparkFun-Resistors:33OHM_RA: EXB-38V330JV Four Resistory Array - AEC-Q200 Certified; PROD_ID: RES-15081
R5 = SparkFun-Resistors:0OHM: 0Ω resistor A resistor is a passive two-terminal electrical component that implements electrical resistance as a circuit element. Resistors act to reduce current flow, and, at the same time, act to lower voltage levels within circuits. - Wikipedia; PROD_ID: RES-08609
R7 R19 = SparkFun-Resistors:1KOHM: 1kΩ resistor A resistor is a passive two-terminal electrical component that implements electrical resistance as a circuit element. Resistors act to reduce current flow, and, at the same time, act to lower voltage levels within circuits. - Wikipedia; PROD_ID: RES-07856
R13 R15 R20 R22 R26 = SparkFun-Resistors:100KOHM: 100kΩ resistor A resistor is a passive two-terminal electrical component that implements electrical resistance as a circuit element. Resistors act to reduce current flow, and, at the same time, act to lower voltage levels within circuits. - Wikipedia; PROD_ID: RES-07828
R14 = SparkFun-Resistors:10OHM: 10Ω resistor A resistor is a passive two-terminal electrical component that implements electrical resistance as a circuit element. Resistors act to reduce current flow, and, at the same time, act to lower voltage levels within circuits. - Wikipedia; PROD_ID: RES-12581
R16 R17 R37 R38 = SparkFun-Resistors:5.1KOHM; PROD_ID: RES-12083
R18 = SparkFun-Resistors:NTC-THERMISTOR: NTC Thermistor An NTC thermistor's resistance decreases as temperature rises. Applications: Resistance Thermometer - temperature monitoring Inrush current limiter Heat source; PROD_ID: RES-13608
R23 R29 R31 = SparkFun-Resistors:10KOHM: 10kΩ resistor A resistor is a passive two-terminal electrical component that implements electrical resistance as a circuit element. Resistors act to reduce current flow, and, at the same time, act to lower voltage levels within circuits. - Wikipedia; PROD_ID: RES-00824
R24 = SparkFun-Resistors:300KOHM: 300kΩ resistor A resistor is a passive two-terminal electrical component that implements electrical resistance as a circuit element. Resistors act to reduce current flow, and, at the same time, act to lower voltage levels within circuits. - Wikipedia; PROD_ID: RES-10809
R27 R28 = SparkFun-Resistors:27OHM: 27Ω resistor A resistor is a passive two-terminal electrical component that implements electrical resistance as a circuit element. Resistors act to reduce current flow, and, at the same time, act to lower voltage levels within circuits. - Wikipedia; PROD_ID: RES-09334
R30 = SparkFun-Resistors:150KOHM: 150kΩ resistor A resistor is a passive two-terminal electrical component that implements electrical resistance as a circuit element. Resistors act to reduce current flow, and, at the same time, act to lower voltage levels within circuits. - Wikipedia; PROD_ID: RES-09117
S1 = SparkFun-Switches:MOMENTARY-SWITCH-SPST: Momentary Switch (Pushbutton) - SPST Normally-open (NO) SPST momentary switches (buttons, pushbuttons). Variants PTH-12MM - 12mm square, through-hole Momentary Pushbutton Switch - 12mm Square <https://www.sparkfun.com/products/9190> (COM-09190) PTH-6.0MM, PTH-6.0MM-KIT - 6.0mm square, through-hole Mini Pushbutton Switch <https://www.sparkfun.com/products/97> (COM-00097) KIT package intended for soldering kit's - only one side of pads' copper is exposed. PTH-RIGHT-ANGLE-KIT - Right-angle, through-hole Right Angle Tactile Button <https://www.sparkfun.com/products/10791> - Used on SparkFun BigTime Watch Kit <https://www.sparkfun.com/products/11734> SMD-12MM - 12mm square, surface-mount Tactile Button - SMD (12mm) <https://www.sparkfun.com/products/12993> (COM-12993) Used on SparkFun PicoBoard <https://www.sparkfun.com/products/11888> SMD-4.5MM - 4.5mm Square Trackball Switch Used on SparkFun Blackberry Trackballer Breakout <https://www.sparkfun.com/products/13169> SMD-4.6MMX2.8MM - 4.60mm x 2.80mm, surface mount Used on SparkFun Pro Micro - RP2040 <https://www.sparkfun.com/products/17717> SMD-5.2MM, SMD-5.2-REDUNDANT - 5.2mm square, surface-mount Mini Pushbutton Switch - SMD <https://www.sparkfun.com/products/8720> (COM-08720) Used on Arduino Pro Mini <https://www.sparkfun.com/products/11114> REDUNDANT package connects both switch circuits together SMD-6.0X3.5MM - 6.0 x 3.5mm, surface mount Momentary Reset Switch SMD <https://www.sparkfun.com/products/8229> (COM-08229) SMD-6.2MM-TALL - 6.2mm square, surface mount Tactile Button - SMD (6mm) <https://www.sparkfun.com/products/12992> Used on SparkFun Digital Sandbox <https://www.sparkfun.com/products/12651> SMD-RIGHT-ANGLE - Right-angle, surface mount Used on SparkFun Block for Intel® Edison - Arduino <https://www.sparkfun.com/products/13036>; PROD_ID: SWCH-14139
U1 = SparkFun-IC-Logic:74*4052: Dual 4:1 Analog Mux Dual four-channel analog MULTIPLEXER / DEMULTIPLEXER SparkFun Products SparkFun Vernier Interface Shield <https://www.sparkfun.com/products/12858> (DEV-12858); PROD_ID: IC-13103
U2 = SparkFun-IC-Power:V_REG_AP2112: AP2112 - 600mA CMOS LDO Regulator w/ Enable The AP2112 is CMOS process low dropout linear regulator with enable function, the regulator delivers a guaranteed 600mA (min.) continuous load current. Features Output Voltage Accuracy: ±1.5% Output Current: 600mA (Min.) Foldback Short Current Protection: 50mA Enable Function to Turn ON/OFF VOUT Low Dropout Voltage (3.3V): 250mV (Typ.) @IOUT=600mA Excellent Load Regulation: 0.2%/A (Typ.) Excellent Line Regulation: 0.02%/V (Typ.) Low Quiescent Current: 55μA (Typ.) Low Standby Current: 0.01μA (Typ.) Low Output Noise: 50μVRMS PSRR: 100Hz -65dB, 1kHz -65dB OTSD Protection Stable with 1.0μF Flexible Cap: Ceramic, Tantalum and Aluminum Electrolytic Operation Temperature Range: -40°C to 85°C ESD: MM 400V, HBM 4000V; PROD_ID: VREG-12457; VALUE: 3.3V
U3 = SparkFun-GPS:U-BLOX_ZED-F9P; PROD_ID: IC-14209
U4 = SparkFun-IC-Power:STLQ015: STLQ015 - 150mA CMOS LDO Regulator w/ Enable 1.4uA quiescent; PROD_ID: IC-15779
U5 = SparkFun-RF:ESP-WROOM-32: ESP-WROOM-32D - trace antenna (includes keepout) ESP-WROOM-32U - U.FL antenna connector Includes both "standard" footprints and "narrow" version (for use with tighter layouts).; PROD_ID: IC-15676
U6 = SparkFun-IC-Comms:CH340C; PROD_ID: IC-14038
U7 = SparkFun-IC-Power:MAX17048: Micropower 1-Cell Li+ ModelGauge SparkFun Products Qduino Mini <https://www.sparkfun.com/products/13614> (DEV-13614); PROD_ID: IC-12551
U10 = SparkFun-IC-Power:MCP73833; PROD_ID: IC-14369
U13 = SparkFun-Sensors:LIS2DH12; DIGIKEY: 497-14851-2-ND; PROD_ID: IC-14229
U$2 = SparkFun-Aesthetics:SPECIAL_INSTRUCTIONS: Special Ordering/Production Instructions Alert Symbol for special PCB ordering instructions or unique production process warnings. Ordering Instructions Production Instructions Types of information that should be added to box: Copper weight Soldermask color Silk color PCB thickness Number of layers PCB Standard: 1.6mm FR4 1 oz copper immersion silver plating red soldermask white silkscreen Types of information that should be added to box: Special wash requirements Depaneling instructions Humidification Glue curing Default text settings: 0.07 inch 9% ratio 50% line distance

## Net classes
1 power: width 0.305 mm
2 3.3V: width 0.559 mm
3 RF: width 0.35 mm, clearance 0.203 mm